# Altium schematic sheet AD5450.SchDoc
size A4
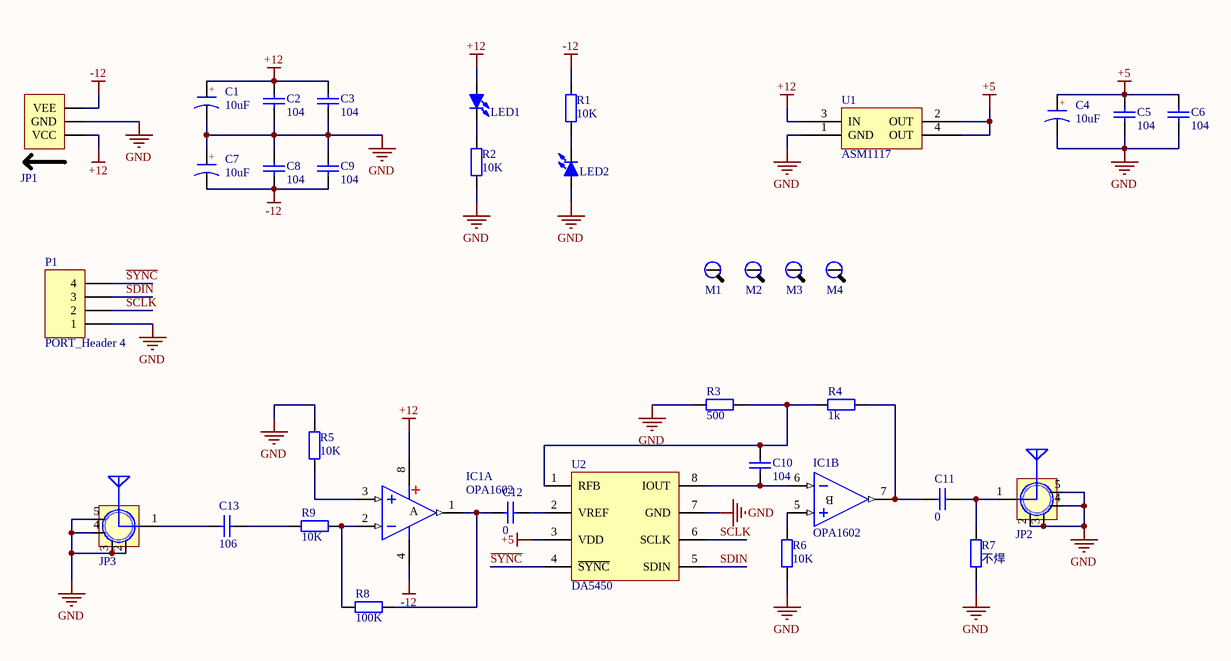
[diagram p0: AD5450.SchDoc]

## Parts
C1  value 10uF  [CASE-A_3216]  (hidden comment: CAP+)
C2  104  [C0603]
C3  104  [C0603]
C4  value 10uF  [CASE-A_3216]  (hidden comment: CAP+)
C5  104  [C0603]
C6  104  [C0603]
C7  value 10uF  [CASE-A_3216]  (hidden comment: CAP+)
C8  104  [C0603]
C9  104  [C0603]
C10  104  [C0603]
C11  value 0  [C0603]  (hidden comment: 104)
C12  value 0  [C0603]  (hidden comment: 104)
C13  value 106  [C0603]  (hidden comment: 104)
IC1  OPA1602  [SOP8_N]  (parts A,B of 2)
JP1  HDR-1X3  [Power_IN_3.81-3P]  (value not drawn)
JP2  SMA WIFI 天线接口  [SMA]  (value not drawn)
JP3  SMA WIFI 天线接口  [SMA]  (value not drawn)
LED1  红色  [LED 0603]  (value not drawn)
LED2  红色  [LED 0603]  (value not drawn)
M1  M3  [M3x10_L]  (value not drawn)
M2  M3  [M3x10_L]  (value not drawn)
M3  M3  [M3x10_L]  (value not drawn)
M4  M3  [M3x10_L]  (value not drawn)
P1  PORT_Header 4  [HDR1X4]
R1  value 10K  [R-0805]  (hidden comment: Res)
R2  value 10K  [R-0805]  (hidden comment: Res)
R3  value 500  [R-0805]  (hidden comment: Res)
R4  value 1k  [R-0805]  (hidden comment: Res)
R5  value 10K  [R-0805]  (hidden comment: Res)
R6  value 10K  [R-0805]  (hidden comment: Res)
R7  value 不焊  [R-0805]  (hidden comment: Res)
R8  value 100K  [R-0805]  (hidden comment: Res)
R9  value 10K  [R-0805]  (hidden comment: Res)
U1  ASM1117  [SOT-223]
U2  DA5450  [SOT23-8L]

## Nets
+5: C4.1(A) C5.2 C6.2 U1.2(OUT) U1.4(OUT) U2.3(VDD)
+12: C1.1(A) C2.2 C3.2 IC1.8(V+) JP1.1(VCC) LED1.1(A) U1.3(IN)
-12: C7.2(K) C8.1 C9.1 IC1.4(V-) JP1.3(VEE) R1.1
GND: C1.2(K) C2.1 C3.1 C4.2(K) C5.1 C6.1 C7.1(A) C8.2 C9.2 JP1.2(GND) JP2.2(GND) JP2.3(GND) JP2.4(GND) JP2.5(GND) JP3.2(GND) JP3.3(GND) JP3.4(GND) JP3.5(GND) LED2.1(A) P1.1 R2.1 R3.1 R5.2 R6.1 R7.1 U1.1(GND) U2.7(GND)
~{SYNC}: P1.4 U2.4(~{SYNC})
SCLK: P1.2 U2.6(SCLK)
SDIN: P1.3 U2.5(SDIN)
NetC10_1: C10.1 IC1.6(IN-) U2.8(IOUT)
NetC10_2: C10.2 R3.2 R4.1 U2.1(RFB)
NetC11_1: C11.1 JP2.1(SINGLE) R7.2
NetC11_2: C11.2 IC1.7(OUT) R4.2
NetC12_1: C12.1 IC1.1(OUT) R8.2
NetC12_2: C12.2 U2.2(VREF)
NetC13_1: C13.1 JP3.1(SINGLE)
NetC13_2: C13.2 R9.2
NetIC1_2: IC1.2(IN-) R8.1 R9.1
NetIC1_3: IC1.3(IN+) R5.1
NetIC1_5: IC1.5(IN+) R6.2
NetLED1_2: LED1.2(K) R2.2
NetLED2_2: LED2.2(K) R1.2

Not connected (* = marked no-connect by the designer): M1 1; M2 1; M3 1; M4 1

## Notes on the sheet
- (in symbol 0CAP+) +
- (in symbol LM358, part A) A
- (in symbol LM358, part B) B

## Library data of the parts
C1 C4 C7 = 0CAP+: 贴片钽电容
C2 C3 C5 C6 C8-C13 = CAP_104
  C2 C3 C5 C6 C8-C10: Value: 104
IC1 = LM358: 双路运放; 版权归属: 源创客; BOM名称: 双路运放; 学习资源: www.ooocke.com
JP1 = PORT_Power_IN3: 3P接插件,模块双电源供电口; 版权归属: 源创客; BOM名称: 3P接插件; 学习资源: www.ooocke.com
JP2 JP3 = PORT_SMA: SMA-2.4G射频天线接口; 版权归属: 源创客; BOM名称: SMA-2.4G射频天线接口; 学习资源: www.ooocke.com
LED1 LED2 = ELSE_LED_SMD: 贴片LED
M1-M4 = ELSE_M3_screw: 螺丝
P1 = PORT_Header 4: Header, 4-Pin; LatestRevisionDate: 17-Jul-2002; LatestRevisionNote: Re-released for DXP Platform.; Publisher: Altium Limited
R1-R9 = 0RES: 小功率贴片电组
U1 = ASM1117: 3.3V稳压芯片